# Altium project HV_BMS.PrjPcb (part 2 of 2)
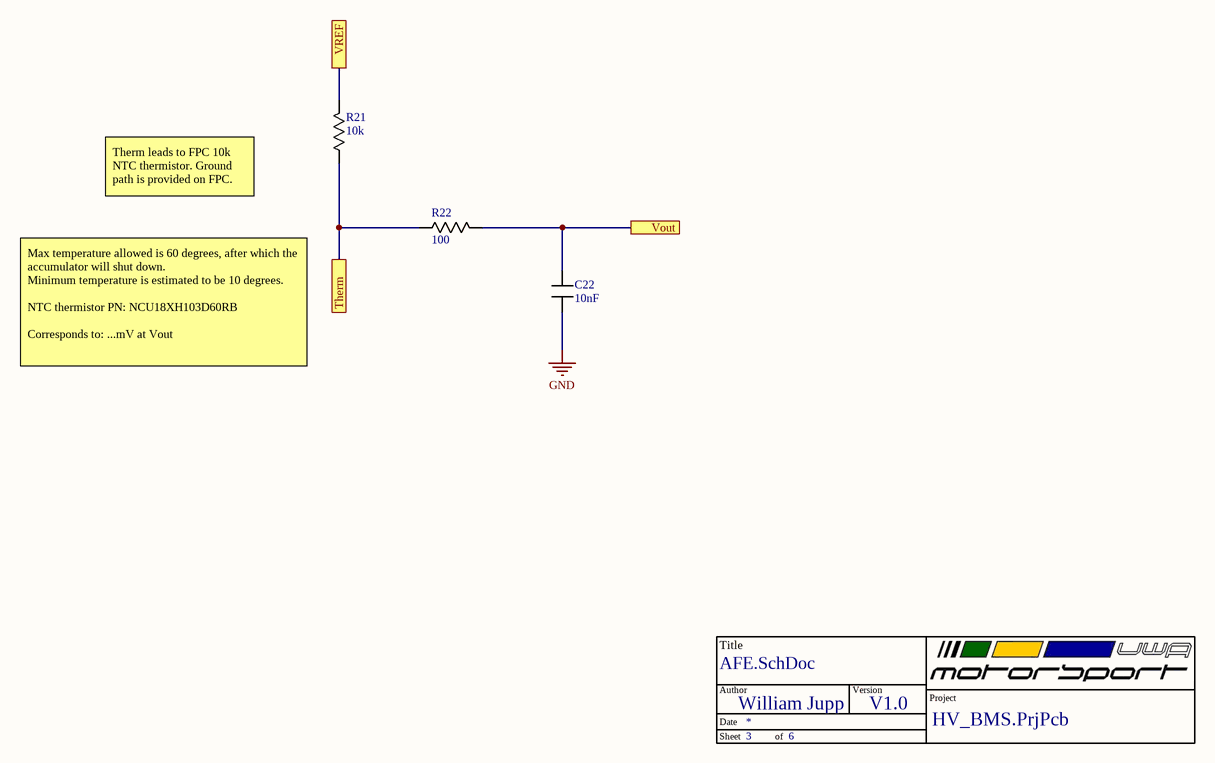
[diagram p6: AFE.SchDoc]

## Nets that join several sheets
+5: LTC6812-1 (11 pins), Temp_Sense (18 pins)
CB1: LTC6812-1 (20 pins), BMS_IC/BC1 (C5_BC1.1 R5_BC1.2 R6_BC1.1), BMS_IC/BC2 (C5_BC2.1), BMS_IC/BC3 (C5_BC3.1), BMS_IC/BC4 (C5_BC4.1), BMS_IC/BC5 (C5_BC5.1), BMS_IC/BC6 (C5_BC6.1), BMS_IC/BC7 (C5_BC7.1), BMS_IC/BC8 (C5_BC8.1), BMS_IC/BC9 (C5_BC9.1), BMS_IC/BC10 (C5_BC10.1), BMS_IC/BC11 (C5_BC11.1), BMS_IC/BC12 (C5_BC12.1), BMS_IC/BC13 (C5_BC13.1), BMS_IC/BC14 (C5_BC14.1), ISO_COMMS (C18.1 C19.1 C20.2 C21.1), Temp_Sense (18 pins), Thermistor_ADC/AFE1 (C22_AFE1.1), Thermistor_ADC/AFE2 (C22_AFE2.1), Thermistor_ADC/AFE3 (C22_AFE3.1), Thermistor_ADC/AFE4 (C22_AFE4.1), Thermistor_ADC/AFE5 (C22_AFE5.1), Thermistor_ADC/AFE6 (C22_AFE6.1), Thermistor_ADC/AFE7 (C22_AFE7.1), Thermistor_ADC/AFE8 (C22_AFE8.1), Thermistor_ADC/AFE9 (C22_AFE9.1), Thermistor_ADC/AFE10 (C22_AFE10.1), Thermistor_ADC/AFE11 (C22_AFE11.1), Thermistor_ADC/AFE12 (C22_AFE12.1), Thermistor_ADC/AFE13 (C22_AFE13.1), Thermistor_ADC/AFE14 (C22_AFE14.1), Thermistor_ADC/AFE15 (C22_AFE15.1), Thermistor_ADC/AFE16 (C22_AFE16.1), Thermistor_ADC/AFE17 (C22_AFE17.1), Thermistor_ADC/AFE18 (C22_AFE18.1), Thermistor_ADC/AFE19 (C22_AFE19.1), Thermistor_ADC/AFE20 (C22_AFE20.1), Thermistor_ADC/AFE21 (C22_AFE21.1), Thermistor_ADC/AFE22 (C22_AFE22.1), Thermistor_ADC/AFE23 (C22_AFE23.1), Thermistor_ADC/AFE24 (C22_AFE24.1), Thermistor_ADC/AFE25 (C22_AFE25.1), Thermistor_ADC/AFE26 (C22_AFE26.1), Thermistor_ADC/AFE27 (C22_AFE27.1), Thermistor_ADC/AFE28 (C22_AFE28.1)
ADCIN1: Temp_Sense (U4.10), Thermistor_ADC/AFE1 (C22_AFE1.2 R22_AFE1.2)
ADCIN2: Temp_Sense (U4.11), Thermistor_ADC/AFE2 (C22_AFE2.2 R22_AFE2.2)
ADCIN3: Temp_Sense (U4.12), Thermistor_ADC/AFE3 (C22_AFE3.2 R22_AFE3.2)
ADCIN4: Temp_Sense (U4.4), Thermistor_ADC/AFE4 (C22_AFE4.2 R22_AFE4.2)
ADCIN5: Temp_Sense (U4.5), Thermistor_ADC/AFE5 (C22_AFE5.2 R22_AFE5.2)
ADCIN6: Temp_Sense (U4.6), Thermistor_ADC/AFE6 (C22_AFE6.2 R22_AFE6.2)
ADCIN7: Temp_Sense (U4.7), Thermistor_ADC/AFE7 (C22_AFE7.2 R22_AFE7.2)
ADCIN8: Temp_Sense (U3.10), Thermistor_ADC/AFE8 (C22_AFE8.2 R22_AFE8.2)
ADCIN9: Temp_Sense (U3.11), Thermistor_ADC/AFE9 (C22_AFE9.2 R22_AFE9.2)
ADCIN10: Temp_Sense (U3.12), Thermistor_ADC/AFE10 (C22_AFE10.2 R22_AFE10.2)
ADCIN11: Temp_Sense (U3.4), Thermistor_ADC/AFE11 (C22_AFE11.2 R22_AFE11.2)
ADCIN12: Temp_Sense (U3.5), Thermistor_ADC/AFE12 (C22_AFE12.2 R22_AFE12.2)
ADCIN13: Temp_Sense (U3.6), Thermistor_ADC/AFE13 (C22_AFE13.2 R22_AFE13.2)
ADCIN14: Temp_Sense (U3.7), Thermistor_ADC/AFE14 (C22_AFE14.2 R22_AFE14.2)
ADCIN15: Temp_Sense (U2.10), Thermistor_ADC/AFE15 (C22_AFE15.2 R22_AFE15.2)
ADCIN16: Temp_Sense (U2.11), Thermistor_ADC/AFE16 (C22_AFE16.2 R22_AFE16.2)
ADCIN17: Temp_Sense (U2.12), Thermistor_ADC/AFE17 (C22_AFE17.2 R22_AFE17.2)
ADCIN18: Temp_Sense (U2.4), Thermistor_ADC/AFE18 (C22_AFE18.2 R22_AFE18.2)
ADCIN19: Temp_Sense (U2.5), Thermistor_ADC/AFE19 (C22_AFE19.2 R22_AFE19.2)
ADCIN20: Temp_Sense (U2.6), Thermistor_ADC/AFE20 (C22_AFE20.2 R22_AFE20.2)
ADCIN21: Temp_Sense (U2.7), Thermistor_ADC/AFE21 (C22_AFE21.2 R22_AFE21.2)
ADCIN22: Temp_Sense (U1.10), Thermistor_ADC/AFE22 (C22_AFE22.2 R22_AFE22.2)
ADCIN23: Temp_Sense (U1.11), Thermistor_ADC/AFE23 (C22_AFE23.2 R22_AFE23.2)
ADCIN24: Temp_Sense (U1.12), Thermistor_ADC/AFE24 (C22_AFE24.2 R22_AFE24.2)
ADCIN25: Temp_Sense (U1.4), Thermistor_ADC/AFE25 (C22_AFE25.2 R22_AFE25.2)
ADCIN26: Temp_Sense (U1.5), Thermistor_ADC/AFE26 (C22_AFE26.2 R22_AFE26.2)
ADCIN27: Temp_Sense (U1.6), Thermistor_ADC/AFE27 (C22_AFE27.2 R22_AFE27.2)
ADCIN28: Temp_Sense (U1.7), Thermistor_ADC/AFE28 (C22_AFE28.2 R22_AFE28.2)
C1: LTC6812-1 (U6.36), BMS_IC/BC1 (C5_BC1.2 R3_BC1.2)
C2: LTC6812-1 (U6.34), BMS_IC/BC2 (C5_BC2.2 R3_BC2.2)
C3: LTC6812-1 (U6.32), BMS_IC/BC3 (C5_BC3.2 R3_BC3.2)
C4: LTC6812-1 (U6.30), BMS_IC/BC4 (C5_BC4.2 R3_BC4.2)
C5: LTC6812-1 (U6.28), BMS_IC/BC5 (C5_BC5.2 R3_BC5.2)
C6: LTC6812-1 (U6.24), BMS_IC/BC6 (C5_BC6.2 R3_BC6.2)
C7: LTC6812-1 (U6.22), BMS_IC/BC7 (C5_BC7.2 R3_BC7.2)
C8: LTC6812-1 (U6.20), BMS_IC/BC8 (C5_BC8.2 R3_BC8.2)
C9: LTC6812-1 (U6.18), BMS_IC/BC9 (C5_BC9.2 R3_BC9.2)
C10: LTC6812-1 (U6.16), BMS_IC/BC10 (C5_BC10.2 R3_BC10.2)
C11: LTC6812-1 (U6.12), BMS_IC/BC11 (C5_BC11.2 R3_BC11.2)
C12: LTC6812-1 (U6.10), BMS_IC/BC12 (C5_BC12.2 R3_BC12.2)
C13: LTC6812-1 (U6.8), BMS_IC/BC13 (C5_BC13.2 R3_BC13.2)
C14: LTC6812-1 (U6.4 U6.6), BMS_IC/BC14 (C5_BC14.2 R3_BC14.2)
CB2: BMS_IC/BC1 (F1_BC1.2 Q1_BC1.2 R3_BC1.1), BMS_IC/BC2 (R5_BC2.2 R6_BC2.1)
CB3: BMS_IC/BC2 (F1_BC2.2 Q1_BC2.2 R3_BC2.1), BMS_IC/BC3 (R5_BC3.2 R6_BC3.1)
CB4: BMS_IC/BC3 (F1_BC3.2 Q1_BC3.2 R3_BC3.1), BMS_IC/BC4 (R5_BC4.2 R6_BC4.1)
CB5: BMS_IC/BC4 (F1_BC4.2 Q1_BC4.2 R3_BC4.1), BMS_IC/BC5 (R5_BC5.2 R6_BC5.1)
CB6: BMS_IC/BC5 (F1_BC5.2 Q1_BC5.2 R3_BC5.1), BMS_IC/BC6 (R5_BC6.2 R6_BC6.1)
CB7: BMS_IC/BC6 (F1_BC6.2 Q1_BC6.2 R3_BC6.1), BMS_IC/BC7 (R5_BC7.2 R6_BC7.1)
CB8: BMS_IC/BC7 (F1_BC7.2 Q1_BC7.2 R3_BC7.1), BMS_IC/BC8 (R5_BC8.2 R6_BC8.1)
CB9: BMS_IC/BC8 (F1_BC8.2 Q1_BC8.2 R3_BC8.1), BMS_IC/BC9 (R5_BC9.2 R6_BC9.1)
CB10: BMS_IC/BC9 (F1_BC9.2 Q1_BC9.2 R3_BC9.1), BMS_IC/BC10 (R5_BC10.2 R6_BC10.1)
CB11: BMS_IC/BC10 (F1_BC10.2 Q1_BC10.2 R3_BC10.1), BMS_IC/BC11 (R5_BC11.2 R6_BC11.1)
CB12: BMS_IC/BC11 (F1_BC11.2 Q1_BC11.2 R3_BC11.1), BMS_IC/BC12 (R5_BC12.2 R6_BC12.1)
CB13: BMS_IC/BC12 (F1_BC12.2 Q1_BC12.2 R3_BC12.1), BMS_IC/BC13 (R5_BC13.2 R6_BC13.1)
CB14: BMS_IC/BC13 (F1_BC13.2 Q1_BC13.2 R3_BC13.1), BMS_IC/BC14 (R5_BC14.2 R6_BC14.1)
FPC1: Temp_Sense (J1.1), Thermistor_ADC/AFE1 (R21_AFE1.1 R22_AFE1.1)
FPC2: Temp_Sense (J1.2), Thermistor_ADC/AFE2 (R21_AFE2.1 R22_AFE2.1)
FPC3: Temp_Sense (J1.3), Thermistor_ADC/AFE3 (R21_AFE3.1 R22_AFE3.1)
FPC4: Temp_Sense (J1.4), Thermistor_ADC/AFE4 (R21_AFE4.1 R22_AFE4.1)
FPC5: Temp_Sense (J1.5), Thermistor_ADC/AFE5 (R21_AFE5.1 R22_AFE5.1)
FPC6: Temp_Sense (J1.6), Thermistor_ADC/AFE6 (R21_AFE6.1 R22_AFE6.1)
FPC7: Temp_Sense (J1.7), Thermistor_ADC/AFE7 (R21_AFE7.1 R22_AFE7.1)
FPC8: Temp_Sense (J1.8), Thermistor_ADC/AFE8 (R21_AFE8.1 R22_AFE8.1)
FPC9: Temp_Sense (J1.9), Thermistor_ADC/AFE9 (R21_AFE9.1 R22_AFE9.1)
FPC10: Temp_Sense (J1.10), Thermistor_ADC/AFE10 (R21_AFE10.1 R22_AFE10.1)
FPC11: Temp_Sense (J1.11), Thermistor_ADC/AFE11 (R21_AFE11.1 R22_AFE11.1)
FPC12: Temp_Sense (J1.12), Thermistor_ADC/AFE12 (R21_AFE12.1 R22_AFE12.1)
FPC13: Temp_Sense (J1.13), Thermistor_ADC/AFE13 (R21_AFE13.1 R22_AFE13.1)
FPC14: Temp_Sense (J1.14), Thermistor_ADC/AFE14 (R21_AFE14.1 R22_AFE14.1)
FPC15: Temp_Sense (J1.15), Thermistor_ADC/AFE15 (R21_AFE15.1 R22_AFE15.1)
FPC16: Temp_Sense (J1.16), Thermistor_ADC/AFE16 (R21_AFE16.1 R22_AFE16.1)
FPC17: Temp_Sense (J1.17), Thermistor_ADC/AFE17 (R21_AFE17.1 R22_AFE17.1)
FPC18: Temp_Sense (J1.18), Thermistor_ADC/AFE18 (R21_AFE18.1 R22_AFE18.1)
FPC19: Temp_Sense (J1.19), Thermistor_ADC/AFE19 (R21_AFE19.1 R22_AFE19.1)
FPC20: Temp_Sense (J1.20), Thermistor_ADC/AFE20 (R21_AFE20.1 R22_AFE20.1)
FPC21: Temp_Sense (J1.21), Thermistor_ADC/AFE21 (R21_AFE21.1 R22_AFE21.1)
FPC22: Temp_Sense (J1.22), Thermistor_ADC/AFE22 (R21_AFE22.1 R22_AFE22.1)
FPC23: Temp_Sense (J1.23), Thermistor_ADC/AFE23 (R21_AFE23.1 R22_AFE23.1)
FPC24: Temp_Sense (J1.24), Thermistor_ADC/AFE24 (R21_AFE24.1 R22_AFE24.1)
FPC25: Temp_Sense (J1.25), Thermistor_ADC/AFE25 (R21_AFE25.1 R22_AFE25.1)
FPC26: Temp_Sense (J1.26), Thermistor_ADC/AFE26 (R21_AFE26.1 R22_AFE26.1)
FPC27: Temp_Sense (J1.27), Thermistor_ADC/AFE27 (R21_AFE27.1 R22_AFE27.1)
FPC28: Temp_Sense (J1.28), Thermistor_ADC/AFE28 (R21_AFE28.1 R22_AFE28.1)
IA_N: LTC6812-1 (U6.61), ISO_COMMS (R20.1 T1.7)
IA_P: LTC6812-1 (U6.62), ISO_COMMS (R19.2 T1.9)
IB_N: LTC6812-1 (U6.63), ISO_COMMS (R18.1 T1.10)
IB_P: LTC6812-1 (U6.64), ISO_COMMS (R17.2 T1.12)
NetU1_8: LTC6812-1 (U6.47), Temp_Sense (U1.8)
NetU2_8: LTC6812-1 (U6.46), Temp_Sense (U2.8)
NetU3_8: LTC6812-1 (U6.45), Temp_Sense (U3.8)
NetU4_8: LTC6812-1 (U6.44), Temp_Sense (U4.8)
S1: LTC6812-1 (U6.37), BMS_IC/BC1 (R4_BC1.2)
S2: LTC6812-1 (U6.35), BMS_IC/BC2 (R4_BC2.2)
S3: LTC6812-1 (U6.33), BMS_IC/BC3 (R4_BC3.2)
S4: LTC6812-1 (U6.31), BMS_IC/BC4 (R4_BC4.2)
S5: LTC6812-1 (U6.29), BMS_IC/BC5 (R4_BC5.2)
S6: LTC6812-1 (U6.25), BMS_IC/BC6 (R4_BC6.2)
S7: LTC6812-1 (U6.23), BMS_IC/BC7 (R4_BC7.2)
S8: LTC6812-1 (U6.21), BMS_IC/BC8 (R4_BC8.2)
S9: LTC6812-1 (U6.19), BMS_IC/BC9 (R4_BC9.2)
S10: LTC6812-1 (U6.17), BMS_IC/BC10 (R4_BC10.2)
S11: LTC6812-1 (U6.13), BMS_IC/BC11 (R4_BC11.2)
S12: LTC6812-1 (U6.11), BMS_IC/BC12 (R4_BC12.2)
S13: LTC6812-1 (U6.9), BMS_IC/BC13 (R4_BC13.2)
S14: LTC6812-1 (U6.7), BMS_IC/BC14 (R4_BC14.2)
SCL: LTC6812-1 (U6.43), Temp_Sense (5 pins)
SDA: LTC6812-1 (U6.42), Temp_Sense (5 pins)
VREF2: LTC6812-1 (C11.2 C12.2 U6.50), Thermistor_ADC/AFE1 (R21_AFE1.2), Thermistor_ADC/AFE2 (R21_AFE2.2), Thermistor_ADC/AFE3 (R21_AFE3.2), Thermistor_ADC/AFE4 (R21_AFE4.2), Thermistor_ADC/AFE5 (R21_AFE5.2), Thermistor_ADC/AFE6 (R21_AFE6.2), Thermistor_ADC/AFE7 (R21_AFE7.2), Thermistor_ADC/AFE8 (R21_AFE8.2), Thermistor_ADC/AFE9 (R21_AFE9.2), Thermistor_ADC/AFE10 (R21_AFE10.2), Thermistor_ADC/AFE11 (R21_AFE11.2), Thermistor_ADC/AFE12 (R21_AFE12.2), Thermistor_ADC/AFE13 (R21_AFE13.2), Thermistor_ADC/AFE14 (R21_AFE14.2), Thermistor_ADC/AFE15 (R21_AFE15.2), Thermistor_ADC/AFE16 (R21_AFE16.2), Thermistor_ADC/AFE17 (R21_AFE17.2), Thermistor_ADC/AFE18 (R21_AFE18.2), Thermistor_ADC/AFE19 (R21_AFE19.2), Thermistor_ADC/AFE20 (R21_AFE20.2), Thermistor_ADC/AFE21 (R21_AFE21.2), Thermistor_ADC/AFE22 (R21_AFE22.2), Thermistor_ADC/AFE23 (R21_AFE23.2), Thermistor_ADC/AFE24 (R21_AFE24.2), Thermistor_ADC/AFE25 (R21_AFE25.2), Thermistor_ADC/AFE26 (R21_AFE26.2), Thermistor_ADC/AFE27 (R21_AFE27.2), Thermistor_ADC/AFE28 (R21_AFE28.2)
VTap1: LTC6812-1 (J2.14), BMS_IC/BC1 (F1_BC1.1)
VTap2: LTC6812-1 (J2.13), BMS_IC/BC2 (F1_BC2.1)
VTap3: LTC6812-1 (J2.12), BMS_IC/BC3 (F1_BC3.1)
VTap4: LTC6812-1 (J2.11), BMS_IC/BC4 (F1_BC4.1)
VTap5: LTC6812-1 (J2.10), BMS_IC/BC5 (F1_BC5.1)
VTap6: LTC6812-1 (J2.9), BMS_IC/BC6 (F1_BC6.1)
VTap7: LTC6812-1 (J2.8), BMS_IC/BC7 (F1_BC7.1)
VTap8: LTC6812-1 (J2.7), BMS_IC/BC8 (F1_BC8.1)
VTap9: LTC6812-1 (J2.6), BMS_IC/BC9 (F1_BC9.1)
VTap10: LTC6812-1 (J2.5), BMS_IC/BC10 (F1_BC10.1)
VTap11: LTC6812-1 (J2.4), BMS_IC/BC11 (F1_BC11.1)
VTap12: LTC6812-1 (J2.3), BMS_IC/BC12 (F1_BC12.1)
VTap13: LTC6812-1 (J2.2), BMS_IC/BC13 (F1_BC13.1)
VTap14: LTC6812-1 (F2.1 J2.1), BMS_IC/BC14 (F1_BC14.1)